# EAGLE design mp3thing_b1 (EAGLE 5.11)
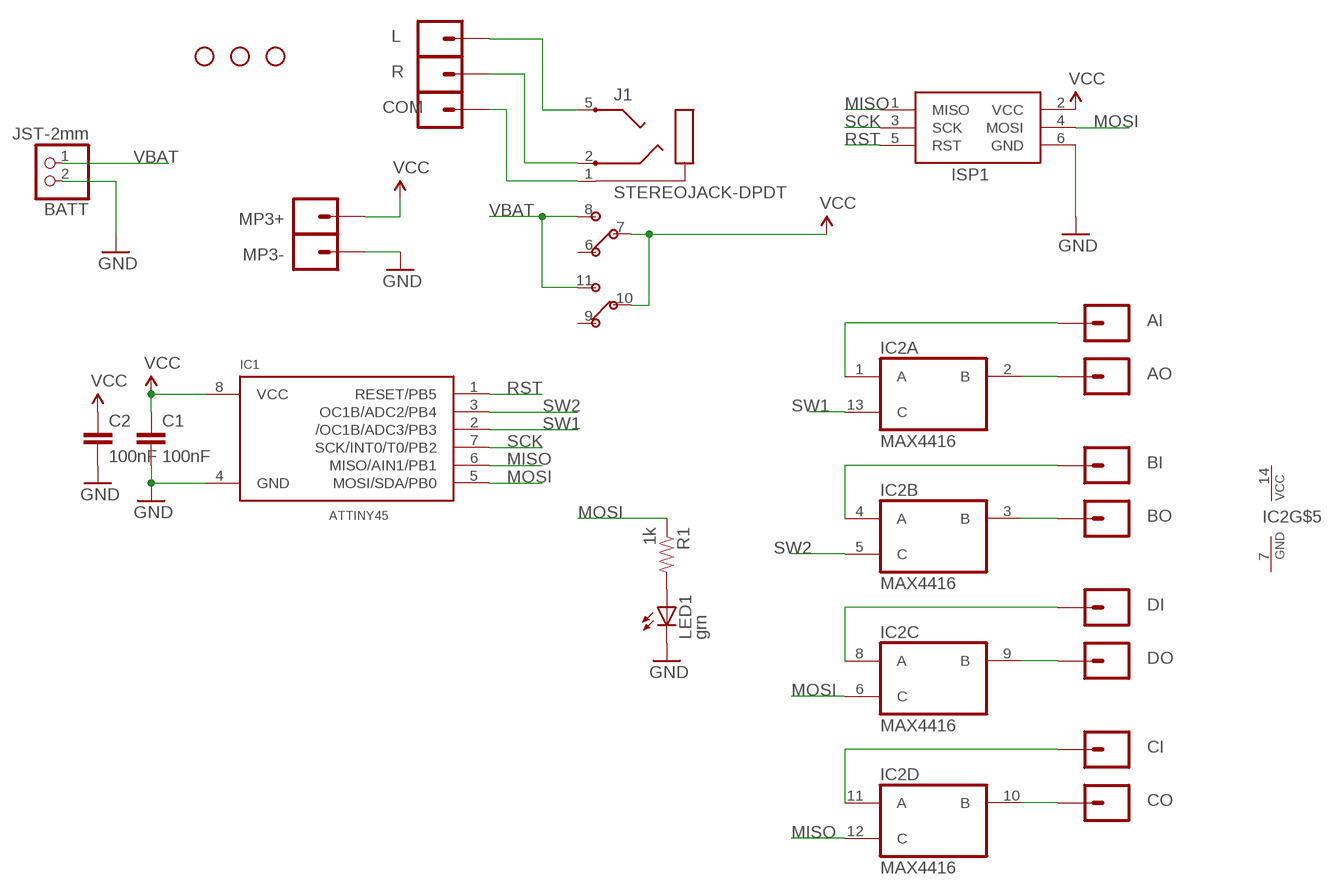
[diagram p0: schematic, sheet 1]

## Parts
AI  M01PTH  [1X01]
AO  M01PTH  [1X01]
BATT  JST-2mm  JST_2PIN-THM-RA  [JST-PH-2-THM-RA]
BI  M01PTH  [1X01]
BO  M01PTH  [1X01]
C1  100nF  CAP0805  [0805]
C2  100nF  CAP0805  [0805]
CI  M01PTH  [1X01]
CO  M01PTH  [1X01]
COM  M01PTH  [1X01]
DI  M01PTH  [1X01]
DO  M01PTH  [1X01]
IC1  ATTINY45  [SO08-EIAJ]
IC2  MAX4416  4066D  [SOIC14]
ISP1  AVRISP-6  [AVRISP]
J1  STEREOJACK-DPDT  [STX3100-9C]
JP1  STAND-OFF  [STAND-OFF]
JP2  STAND-OFF  [STAND-OFF]
JP3  STAND-OFF  [STAND-OFF]
L  M01PTH  [1X01]
LED1  grn  LED-FKIT-1206  [FKIT-LED-1206]
MP3+  M01PTH  [1X01]
MP3-  M01PTH  [1X01]
R  M01PTH  [1X01]
R1  1k  RESISTOR0805-RES  [0805]

## Nets
GND: BATT.2 C1.2 C2.2 IC1.4(GND) ISP1.6(GND) LED1.C MP3-.1
MISO: IC1.6(MISO/AIN1/PB1) IC2.12(D:C) ISP1.1(MISO)
MOSI: IC1.5(MOSI/SDA/PB0) IC2.6(C:C) ISP1.4(MOSI) R1.1
N$1: COM.1 J1.1
N$2: BI.1 IC2.4(B:A)
N$3: LED1.A R1.2
N$4: AO.1 IC2.2(A:B)
N$5: AI.1 IC2.1(A:A)
N$6: BO.1 IC2.3(B:B)
N$7: J1.5 L.1
N$8: J1.2 R.1
N$9: DI.1 IC2.8(C:A)
N$10: DO.1 IC2.9(C:B)
N$14: CI.1 IC2.11(D:A)
N$15: CO.1 IC2.10(D:B)
RST: IC1.1(RESET/PB5) ISP1.5(RST)
SCK: IC1.7(SCK/INT0/T0/PB2) ISP1.3(SCK)
SW1: IC1.2(/OC1B/ADC3/PB3) IC2.13(A:C)
SW2: IC1.3(OC1B/ADC2/PB4) IC2.5(B:C)
VBAT: BATT.1 J1.8 J1.11
VCC: C1.1 C2.1 IC1.8(VCC) ISP1.2(VCC) J1.7 J1.10 MP3+.1
Unconnected: J1.6 J1.9

## Power pins joined to a net without a drawn wire
GND: IC2.7(GND)
VCC: IC2.14(VCC)

## Library data of the parts
AI AO BI BO CI CO COM DI DO L MP3+ MP3- R = SparkFun-20110517:M01: Header 1 Standard 1-pin 0.1" header. Use with straight break away headers (SKU : PRT-00116), right angle break away headers (PRT-00553), swiss pins (PRT-00743), machine pins (PRT-00117), and female headers (PRT-00115).
BATT = adafruit-20120122:JST_2PIN: JST 2-Pin Connectors of various flavors SMT-RA (S2B-PH-SM4) 4UConnector #17311 SMT (B2B-PH-SM4) THM-RA (S2B-PH) THM (B2B-PH)
C1 C2 = SparkFun-20110511:CAP: Capacitor Standard 0603 ceramic capacitor, and 0.1" leaded capacitor.
IC1 = todstuff:ATTINY45
IC2 = todstuff:4066
ISP1 = adafruit-20120122:AVRISP: AVR ISP HEADER Standard 6 pin header for AVR programming
J1 = todstuff:STEREOJACK-DPDT
JP1-JP3 = SparkFun-20110517:STAND-OFF: Stand Off This is the mechanical footprint for a #4 phillips button head screw. Use the keepout ring to avoid running the screw head into surrounding components. SKU : PRT-00447
LED1 = SparkFun-20110517:LED: LEDs Standard schematic elements and footprints for 5mm, 3mm, 1206, and 0603 sized LEDs. 5mm - Spark Fun Electronics SKU : COM-00529 (and others)
R1 = SparkFun-20110517:RESISTOR: Resistor Basic schematic elements and footprints for 0603, 1206, and PTH resistors.

## Board
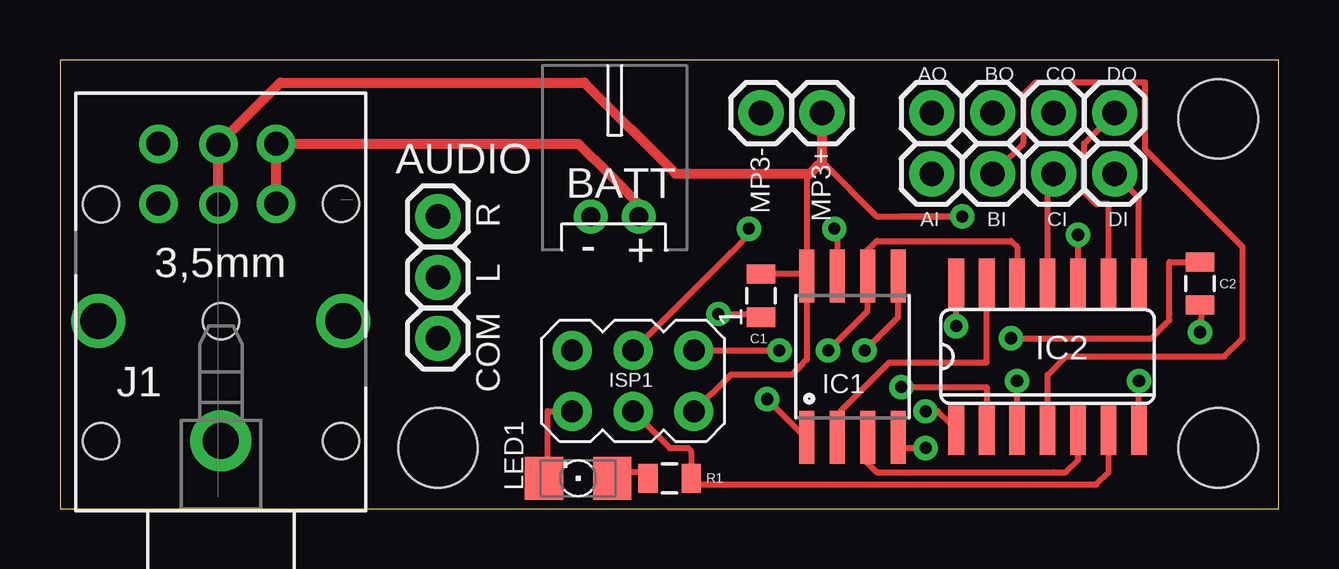
[diagram p1: board, top side]
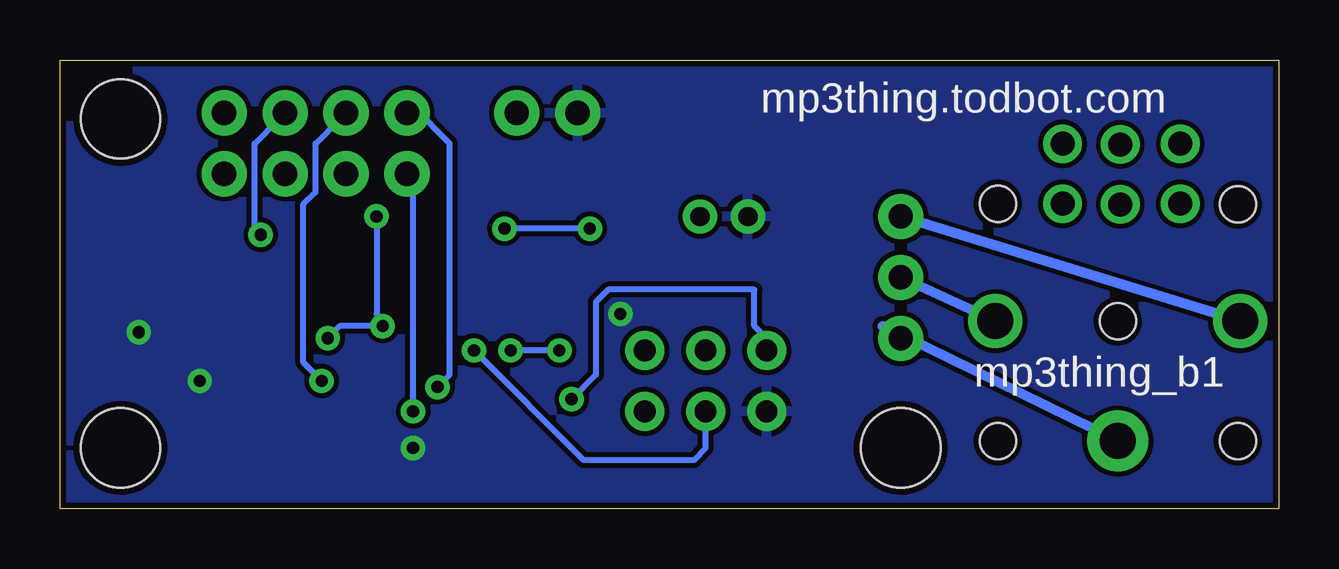
[diagram p2: board, bottom side, seen from below]

Size 50.78 x 18.72 mm. Coordinates in mm from the lower left corner, seen from the top.
Outline: 0,0 50.78,0 50.78,18.72 0,18.72 0,0
Copper layers (1*16): Top 0.035mm / dielectric 1.5mm / Bottom 0.035mm
Design rules "SparkFun *": minimum track width 10mil, minimum drill 20mil, track to track 8mil, track to pad 8mil, pad to pad 8mil, via to via 8mil, smd to smd 8mil, copper to edge 10mil, drill to drill 8mil, minimum pad ring 12mil, minimum via ring 10mil, stop-mask expansion 4mil, vias tented up to drill 25mil, thermal gap 10mil

### Footprints (pad centres in the part's own frame; a part is rotated, then mirrored left to right if it is on the bottom)
1X01 = drill 1.016 pad 1.88 round: 1 0,0
JST-PH-2-THM-RA = drill 0.8 pad 1.422 round: 1 1,0; 2 -1,0
0805 = smd 0.8 x 1.2: 1 -0.9,0; 2 0.9,0
SO08-EIAJ = smd 0.61 x 2.21: 1 -1.905,-3.378; 2 -0.635,-3.378; 3 0.635,-3.378; 4 1.905,-3.378; 5 1.905,3.353; 6 0.635,3.353; 7 -0.635,3.353; 8 -1.905,3.353
SOIC14 = smd 0.66 x 2.032: 1 -3.81,-3.073; 2 -2.54,-3.073; 3 -1.27,-3.073; 4 0,-3.073; 5 1.27,-3.073; 6 2.54,-3.073; 7 3.81,-3.073; 8 3.81,3.073; 9 2.54,3.073; 10 1.27,3.073; 11 0,3.073; 12 -1.27,3.073; 13 -2.54,3.073; 14 -3.81,3.073
AVRISP = drill 0.9 pad 1.626 round: 1 -1.27,2.54; 2 1.27,2.54; 3 -1.27,0; 4 1.27,0; 5 -1.27,-2.54; 6 1.27,-2.54
STX3100-9C = drill 1.5 pad 2.54 round: 1 1.43,-0.1 | drill 1.5 round: 2 6.43,5; 5 6.43,-5.2 | drill 1 round: 6 11.33,2.5; 7 11.3,0; 8 11.33,-2.4; 9 13.83,2.5; 10 13.8,0; 11 13.83,-2.4 | hole 1.5: 1.43,4.9; 1.43,-5.1; 6.43,-0.1; 11.295,4.9; 11.33,-5.1
STAND-OFF = hole 3.302: 0,0
FKIT-LED-1206 = smd 1.6 x 1.803: A -1.422,0; C 1.422,0

### Placement (x,y rotation side)
AI  36.32,13.97 0 top
AO  36.32,16.51 0 top
BATT  23.11,12.19 0 top
BI  38.86,13.97 0 top
BO  38.86,16.51 0 top
C1  29.21,8.89 270 top
C2  47.5,9.4 270 top
CI  41.4,13.97 0 top
CO  41.4,16.51 0 top
COM  15.75,7.11 270 top
DI  43.94,13.97 0 top
DO  43.94,16.51 0 top
IC1  33.02,6.35 0 top
IC2  41.15,6.35 0 top
ISP1  23.88,5.33 270 top
J1  6.6,1.4 90 top
JP1  15.75,2.54 0 top
JP2  48.26,16.26 0 top
JP3  48.26,2.54 0 top
L  15.75,9.65 270 top
LED1  21.59,1.27 180 top
MP3+  31.75,16.51 0 top
MP3-  29.21,16.51 0 top
R  15.75,12.19 270 top
R1  25.4,1.27 180 top

### Tracks (layer width: path | path; a pad name or v marks a point on that pad's centre or on a via)
GND  (via drill 0.51)
  Top 0.254: v27.43,8.13 28.96,8.13 C1.2 | ISP1.6 20.32,4.06 20.32,1.52 LED1.C | v36.07,2.54 35.05,2.54 IC1.4 | IC2.7 v44.96,5.33 | C2.2 47.64,8.5 v47.5,7.37
  pour Bottom: 0,22.86 0,-1.27 53.34,-1.27 52.07,22.86
MISO  (via drill 0.51)
  Top 0.254: ISP1.1 v29.97,6.6 | IC1.6 33.53,9.65 | IC1.6 33.66,8.26 v32,6.6 | IC2.12 39.88,10.92 39.62,11.18 34.04,11.18 33.66,10.79 IC1.6
  Bottom 0.254: v29.97,6.6 v32,6.6
MOSI  (via drill 0.51)
  Top 0.254: IC2.6 43.69,3.05 43.69,1.52 43.18,1.02 26.55,1.02 R1.1 | R1.1 26.42,1.02 | IC1.5 34.92,8 v33.53,6.6 | R1.1 26.3,2.4 26.16,2.54 25.4,2.54 ISP1.4
  Bottom 0.254: v33.53,6.6 28.96,2.03 24.38,2.03 23.88,2.54 ISP1.4
N$1
  Bottom 0.254: 15.69,7.22 COM.1
  Bottom 0.406: J1.1 15.69,7.22 16.51,7.62
N$2
  Top 0.254: 41.15,3.56 IC2.4 41.15,5.59 41.91,6.35 48.51,6.35 49.28,7.11 49.28,10.92 45.21,14.99 45.21,17.78 40.64,17.78 40.13,17.27 40.13,15.24 39.12,14.22 BI.1
N$3
  Top 0.254: R1.2 24.38,1.52 23.37,1.52 LED1.A
N$4  (via drill 0.51)
  Top 0.254: v35.05,5.08 38.61,5.08 38.61,3.56 IC2.2
  Bottom 0.254: v35.05,5.08 34.54,5.59 34.54,15.24 36.07,16.76 AO.1
N$5  (via drill 0.51)
  Top 0.254: v36.07,4.06 36.58,4.06 37.08,3.56 IC2.1
  Bottom 0.254: v36.07,4.06 36.07,13.72 AI.1
N$6  (via drill 0.51)
  Top 0.254: 39.88,3.56 IC2.3 v39.88,5.33
  Bottom 0.254: v39.88,5.33 40.64,6.1 40.64,12.7 40.13,13.21 40.13,15.24 39.12,16.26 BO.1
N$7
  Bottom 0.406: J1.5 L.1
N$8
  Bottom 0.406: J1.2 R.1
N$9
  Top 0.254: DI.1 44.96,12.95 IC2.8
N$10
  Top 0.254: IC2.9 43.69,9.65 43.69,12.7 43.18,12.7 42.67,13.21 42.67,15.24 43.69,16.26 DO.1
N$14
  Top 0.254: IC2.11 41.15,9.65 41.15,13.72 CI.1
N$15  (via drill 0.51)
  Top 0.254: IC2.10 v42.42,11.43
  Bottom 0.254: v42.42,11.43 42.67,11.68 42.67,15.24 41.66,16.26 CO.1
RST  (via drill 0.51)
  Top 0.254: v29.46,4.57 30.99,3.05 IC1.1
  Bottom 0.254: v29.46,4.57 28.45,5.59 28.45,8.64 27.94,9.14 21.84,9.14 21.84,7.62 21.34,7.11 ISP1.5
SCK  (via drill 0.51)
  Top 0.254: ISP1.3 27.94,10.67 28.7,11.43 v28.7,11.68 | 32.38,11.56 32.51,11.68 | 32.38,11.56 IC1.7 | v32.26,11.68 32.38,11.56
  Bottom 0.254: v28.7,11.68 v32.26,11.68
SW1
  Top 0.254: IC2.13 38.61,9.14 38.61,6.1 34.54,6.1 32.51,4.06 32.51,3.05 IC1.2
SW2
  Top 0.254: IC1.3 33.53,2.54 33.53,2.03 34.04,1.52 41.4,1.52 41.91,1.52 42.42,2.03 IC2.5
VBAT
  Top 0.406: J1.8 J1.11 21.6,15.23 22.86,13.97 24.11,12.72 BATT.1
VCC  (via drill 0.51)
  Top 0.254: ISP1.2 27.94,5.59 30.48,5.59 30.86,5.97 | 30.86,5.97 30.99,6.1 | J1.10 6.6,15.24 | IC2.14 37.34,7.87 v37.34,7.62 | 35.05,12.19 v37.59,12.19 34.04,12.19 31.75,14.48 | C1.1 31.03,9.79 IC1.8 | IC1.8 31.11,13.84 31.5,14.22 | IC1.8 31.11,6.22 30.86,5.97 | v39.62,7.11 45.47,7.11 45.72,7.37 46.23,7.87 46.23,8.13 46.23,10.3 C2.1
  Top 0.406: MP3+.1 31.75,14.48 31.5,14.22 31.24,13.97 25.65,13.97 21.84,17.78 9.19,17.78 J1.10 J1.7
  Bottom 0.254: v39.62,7.11 39.12,7.62 v37.34,7.62 37.59,8.13 v37.59,12.19

### Text on the board
tPlace: AUDIO
bPlace: mp3thing.todbot.com | mp3thing_b1